# EAGLE design altimetr (EAGLE 9.6.2)
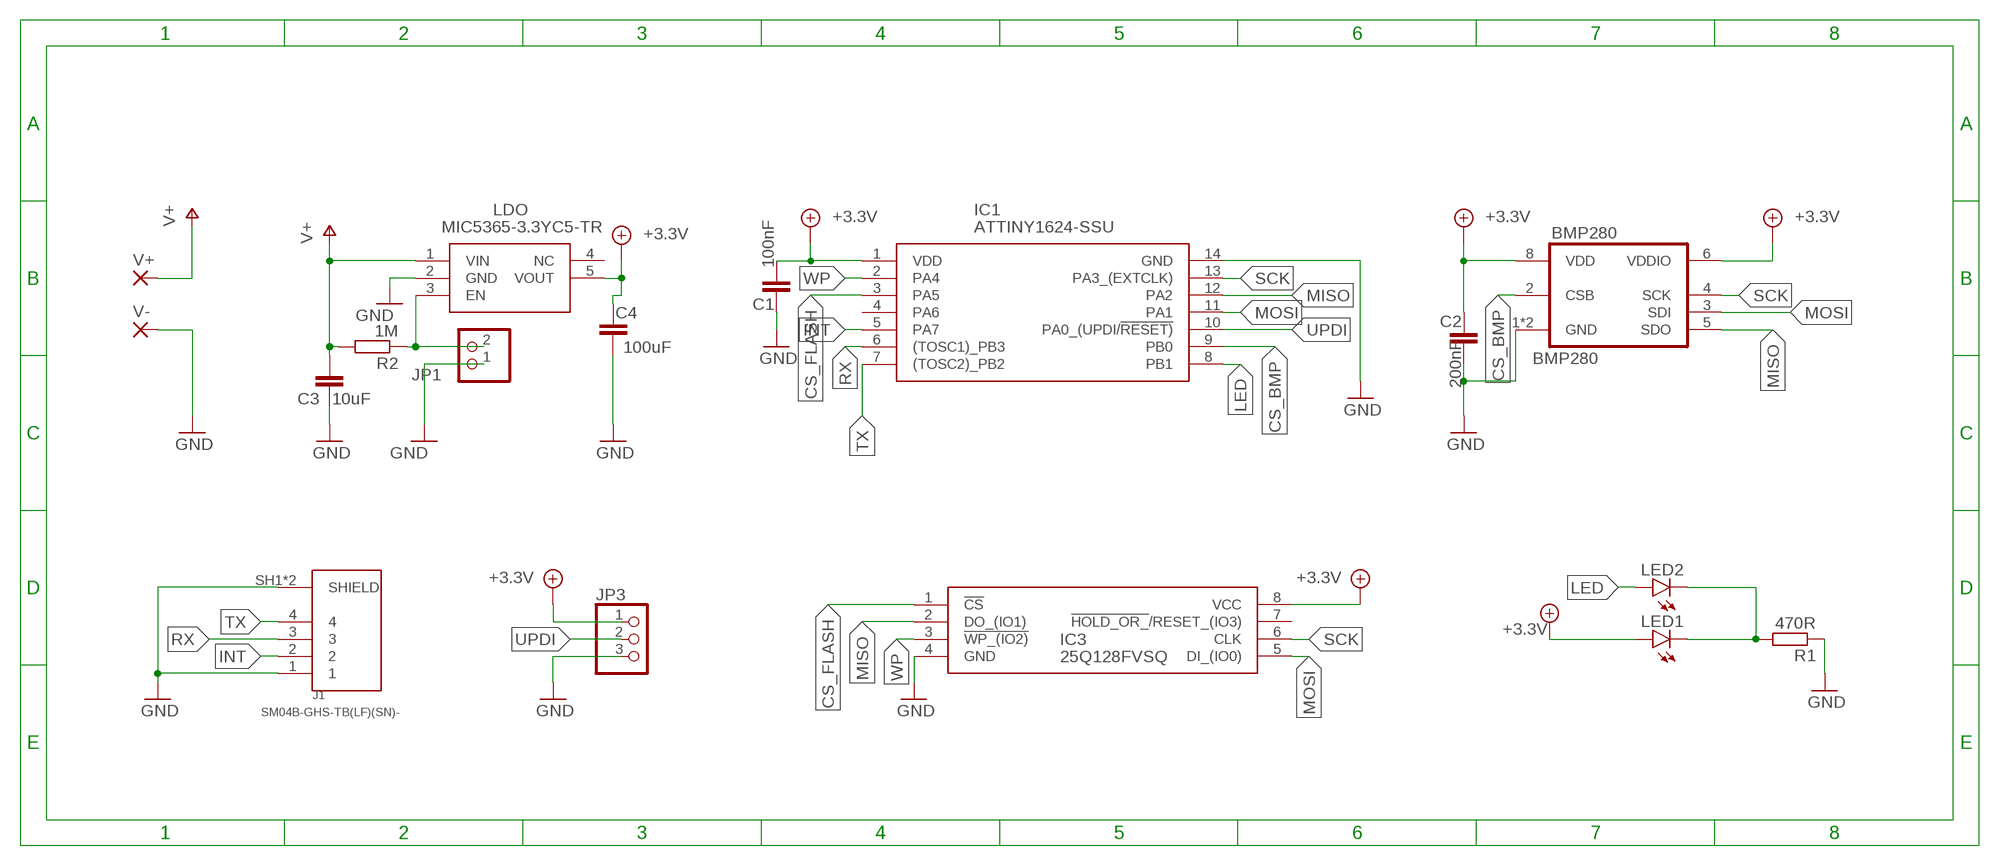
[diagram p0: schematic, sheet 1]

## Parts
BMP280  BMP280  [BMP280]
C1  100nF  C-EUC0805  [C0805]
C2  200nF  C-EUC0805  [C0805]
C3  10uF  C-EUC0805  [C0805]
C4  100uF  C-EUC0805  [C0805]
IC1  ATTINY1624-SSU  [SOIC127P600X175-14N]
IC3  25Q128FVSQ  [SOIC127P790X216-8N]
J1  SM04B-GHS-TB(LF)(SN)-  [JST_SM04B-GHS-TB(LF)(SN)-]
JP1  PINHD-1X2/90  [1X02/90]
JP3  PINHD-1X3/90  [1X03/90]
LDO  MIC5365-3.3YC5-TR  [SOT65P210X110-5N]
LED1  LEDCHIP-LED0805  [CHIP-LED0805]
LED2  LEDCHIP-LED0805  [CHIP-LED0805]
R1  470R  R-EU_R0805  [R0805]
R2  1M  R-EU_R0805  [R0805]
V+  SMD2  [SMD1,27-2,54]
V-  SMD2  [SMD1,27-2,54]

## Nets
+3.3V: BMP280.6(VDDIO) BMP280.8(VDD) C1.1 C2.1 C4.2 IC1.1(VDD) IC3.8(VCC) JP3.1 LDO.5(VOUT) LED1.A
CS_BMP: BMP280.2(CSB) IC1.9(PB0)
CS_FLASH: IC1.3(PA5) IC3.1(!CS)
EN: JP1.2 LDO.3(EN) R2.1
GND: BMP280.1(GND) BMP280.7(GND) C1.2 C2.2 C3.1 C4.1 IC1.14(GND) IC3.4(GND) J1.1 J1.SH1(SHIELD) J1.SH2(SHIELD) JP1.1 JP3.3 LDO.2(GND) R1.1 V-.1(P)
INT: IC1.5(PA7) J1.2
LED: IC1.8(PB1) LED2.A
MISO: BMP280.5(SDO) IC1.12(PA2) IC3.2(DO_(IO1))
MOSI: BMP280.3(SDI) IC1.11(PA1) IC3.5(DI_(IO0))
N$14: LED1.C LED2.C R1.2
RX: IC1.6((TOSC1)_PB3) J1.3
SCK: BMP280.4(SCK) IC1.13(PA3_(EXTCLK)) IC3.6(CLK)
TX: IC1.7((TOSC2)_PB2) J1.4
UPDI: IC1.10(PA0_(UPDI/!RESET)) JP3.2
V+: C3.2 LDO.1(VIN) R2.2 V+.1(P)
WP: IC1.2(PA4) IC3.3(!WP_(IO2))
Unconnected: IC1.4(PA6) IC3.7(!HOLD_OR_!/RESET_(IO3)) LDO.4(NC)

## Library data of the parts
BMP280 = PUTRocketLab_modules:BMP280: The BMP280 is an absolute barometric pressure sensor especially designed for mobile applications. The sensor module is housed in an extremely compact 8-pin metal-lid LGA package with a footprint of only 2.0 × 2.5 mm2 and 0.95 mm package height. Its small dimensions and its low power consumption of 2.7 μA @1Hz allow the implementation in battery driven devices such as mobile phones, GPS modules or watches. The library has been designed by Richard Magdycz <https://www.facebook.com/groups/eaglecadsoftUK>
C1 C3 C4 = rcl:C-EU: CAPACITOR, European symbol; SPICEPREFIX: C
C2 = PUTRocketLab_RCL:C-EU: CAPACITOR, European symbol; SPICEPREFIX: C
IC1 = ATTINY1624-SSU:ATTINY1624-SSU: Microchip ATTINY1624-SSU, 8bit AVR Microcontroller, ATtiny1624, 20MHz, 16 kB Flash, 14-Pin SOIC14 Source: Datasheet <https://ww1.microchip.com/downloads/en/DeviceDoc/ATtiny1624-26-27-DataSheet-DS40002234A.pdf>; DESCRIPTION: Microchip ATTINY1624-SSU, 8bit AVR Microcontroller, ATtiny1624, 20MHz, 16 kB Flash, 14-Pin SOIC14; HEIGHT: 1.75mm; MANUFACTURER_NAME: Microchip; MANUFACTURER_PART_NUMBER: ATTINY1624-SSU; MOUSER_PART_NUMBER: 556-ATTINY1624-SSU; MOUSER_PRICE-STOCK: https://www.mouser.co.uk/ProductDetail/Microchip-Technology-Atmel/ATTINY1624-SSU?qs=vmHwEFxEFR%2FHKYGUmUC%2Fzw%3D%3D
IC3 = 25Q128FVSQ:25Q128FVSQ: 3V 128M-BIT SERIAL FLASH MEMORY WITH DUAL/QUAD SPI & QPI Source: Datasheet <http://www.datasheetbank.com/datasheet-download/691593/1/Winbond/25Q128FVSQ>; DESCRIPTION: 3V 128M-BIT SERIAL FLASH MEMORY WITH DUAL/QUAD SPI & QPI; HEIGHT: 2.16mm; MANUFACTURER_NAME: Winbond; MANUFACTURER_PART_NUMBER: 25Q128FVSQ
J1 = PUTRocketLab_connectors:SM04B-GHS-TB(LF)(SN)-: Conn Header Gh Side 4pos 1.25mm; DESCRIPTION: Connector Header Surface Mount, Right Angle 4 position 0.049 (1.25mm); DIGI-KEY_PART_NUMBER: 455-1566-6-ND; MF: JST Sales; MP: SM04B-GHS-TB(LF)(SN)-; PACKAGE: None; PURCHASE-URL: https://pricing.snapeda.com/search/part/SM04B-GHS-TB(LF)(SN)-/?ref=eda
JP1 = pinhead:PINHD-1X2: PIN HEADER
JP3 = pinhead:PINHD-1X3: PIN HEADER
LDO = MIC5365-3.3YC5-TR:MIC5365-3.3YC5-TR: MICROCHIP - MIC5365-3.3YC5-TR - LDO, FIXED, 3.3V, 0.15A, SC-70-5 Source: Datasheet <http://www.mouser.com/ds/2/268/mic5365-779177.pdf>; ARROW_PART_NUMBER: MIC5365-3.3YC5-TR; ARROW_PRICE-STOCK: https://www.arrow.com/en/products/mic5365-3.3yc5-tr/microchip-technology?region=nac; DESCRIPTION: MICROCHIP - MIC5365-3.3YC5-TR - LDO, FIXED, 3.3V, 0.15A, SC-70-5; HEIGHT: 1.1mm; MANUFACTURER_NAME: Microchip; MANUFACTURER_PART_NUMBER: MIC5365-3.3YC5-TR; MOUSER_PART_NUMBER: 998-MIC5365-3.3YC5TR; MOUSER_PRICE-STOCK: https://www.mouser.co.uk/ProductDetail/Microchip-Technology-Micrel/MIC5365-33YC5-TR?qs=U6T8BxXiZAXvJj%252BPZ%252B301w%3D%3D
LED1 LED2 = led:LED: LED OSRAM: - CHIPLED LG R971, LG N971, LY N971, LG Q971, LY Q971, LO R971, LY R971 LH N974, LH R974 LS Q976, LO Q976, LY Q976 LO Q996 - Hyper CHIPLED LW Q18S LB Q993, LB Q99A, LB R99A - SideLED LS A670, LO A670, LY A670, LG A670, LP A670 LB A673, LV A673, LT A673, LW A673 LH A674 LY A675 LS A676, LA A676, LO A676, LY A676, LW A676 LS A679, LY A679, LG A679 - Hyper Micro SIDELED® LS Y876, LA Y876, LO Y876, LY Y876 LT Y87S - SmartLED LW L88C, LW L88S LB L89C, LB L89S, LG L890 LS L89K, LO L89K, LY L89K LS L896, LA L896, LO L896, LY L896 - TOPLED LS T670, LO T670, LY T670, LG T670, LP T670 LSG T670, LSP T670, LSY T670, LOP T670, LYG T670 LG T671, LOG T671, LSG T671 LB T673, LV T673, LT T673, LW T673 LH T674 LS T676, LA T676, LO T676, LY T676, LB T676, LH T676, LSB T676, LW T676 LB T67C, LV T67C, LT T67C, LS T67K, LO T67K, LY T67K, LW E67C LS E67B, LA E67B, LO E67B, LY E67B, LB E67C, LV E67C, LT E67C LW T67C LS T679, LY T679, LG T679 LS T770, LO T770, LY T770, LG T770, LP T770 LB T773, LV T773, LT T773, LW T773 LH T774 LS E675, LA E675, LY E675, LS T675 LS T776, LA T776, LO T776, LY T776, LB T776 LHGB T686 LT T68C, LB T68C - Hyper Mini TOPLED® LB M676 - Mini TOPLED Santana® LG M470 LS M47K, LO M47K, LY M47K Source: http://www.osram.convergy.de LUXEON: - LUMILED® LXK2-PW12-R00, LXK2-PW12-S00, LXK2-PW14-U00, LXK2-PW14-V00 LXK2-PM12-R00, LXK2-PM12-S00, LXK2-PM14-U00 LXK2-PE12-Q00, LXK2-PE12-R00, LXK2-PE12-S00, LXK2-PE14-T00, LXK2-PE14-U00 LXK2-PB12-K00, LXK2-PB12-L00, LXK2-PB12-M00, LXK2-PB14-N00, LXK2-PB14-P00, LXK2-PB14-Q00 LXK2-PR12-L00, LXK2-PR12-M00, LXK2-PR14-Q00, LXK2-PR14-R00 LXK2-PD12-Q00, LXK2-PD12-R00, LXK2-PD12-S00 LXK2-PH12-R00, LXK2-PH12-S00 LXK2-PL12-P00, LXK2-PL12-Q00, LXK2-PL12-R00 Source: www.luxeon.com KINGBRIGHT: KA-3528ASYC Source: www.kingbright.com
R1 = rcl:R-EU_: RESISTOR, European symbol; SPICEPREFIX: R
R2 = PUTRocketLab_RCL:R-EU_: RESISTOR, European symbol; SPICEPREFIX: R
V+ V- = wirepad:SMD2: SMD PAD

## Board
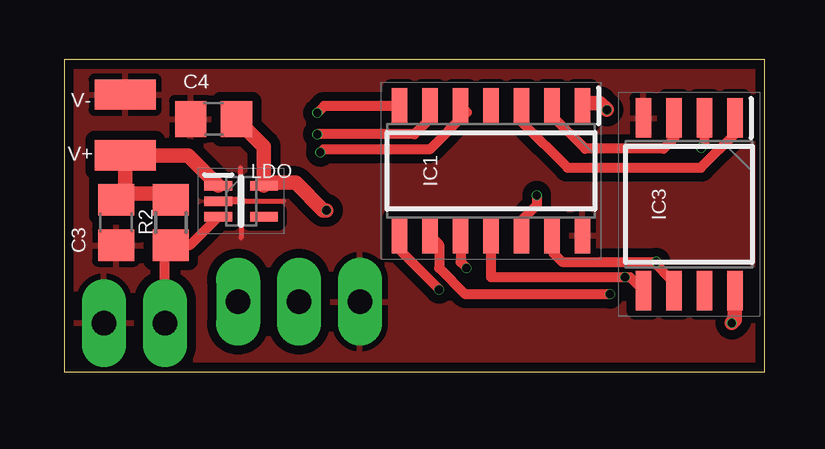
[diagram p1: board, top side]
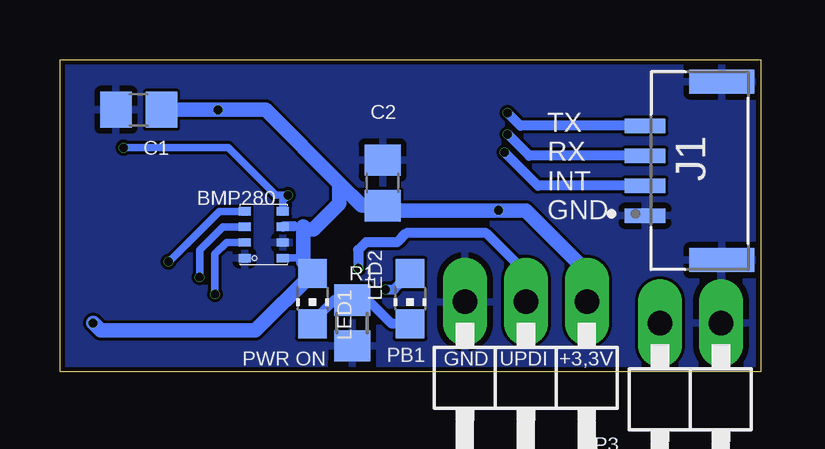
[diagram p2: board, bottom side, seen from below]

Size 29.19 x 13.01 mm. Coordinates in mm from the lower left corner, seen from the top.
Outline: 0,0 29.19,0 29.19,13.01 0,13.01 0,0
Copper layers (1*16): Top 0.035mm / dielectric 1.6mm / Bottom 0.035mm
Design rules "jlcpcb-2layers *": minimum track width 5mil, minimum drill 0.3mm, track to track 5mil, track to pad 5mil, pad to pad 5mil, via to via 5mil, smd to smd 5mil, copper to edge 0.2mm, drill to drill 6mil, minimum pad ring 10mil, minimum via ring 1mil, stop-mask expansion 4mil, vias tented up to drill 0mil, thermal gap 10mil

### Footprints (pad centres in the part's own frame; a part is rotated, then mirrored left to right if it is on the bottom)
BMP280 = smd 0.35 x 0.5: 1 0.975,-0.8; 2 0.325,-0.8; 3 -0.325,-0.8; 4 -0.975,-0.8; 5 -0.975,0.8; 6 -0.325,0.8; 7 0.325,0.8; 8 0.975,0.8
C0805 = smd 1.3 x 1.5: 1 -0.95,0; 2 0.95,0
SOIC127P600X175-14N = smd 1.5 x 0.65: 1 -2.7,3.81; 2 -2.7,2.54; 3 -2.7,1.27; 4 -2.7,0; 5 -2.7,-1.27; 6 -2.7,-2.54; 7 -2.7,-3.81; 8 2.7,-3.81; 9 2.7,-2.54; 10 2.7,-1.27; 11 2.7,0; 12 2.7,1.27; 13 2.7,2.54; 14 2.7,3.81
SOIC127P790X216-8N = smd 1.65 x 0.65: 1 -3.6,1.905; 2 -3.6,0.635; 3 -3.6,-0.635; 4 -3.6,-1.905; 5 3.6,-1.905; 6 3.6,-0.635; 7 3.6,0.635; 8 3.6,1.905
JST_SM04B-GHS-TB(LF)(SN)- = smd 0.6 x 1.7: 1 -1.875,2.275; 2 -0.625,2.275; 3 0.625,2.275; 4 1.875,2.275 | smd 1 x 2.7: SH1 -3.725,-0.925; SH2 3.725,-0.925
1X02/90 = drill 1.016 long: 1 -1.27,-3.81; 2 1.27,-3.81
1X03/90 = drill 1.016 long: 1 -2.54,-3.81; 2 0,-3.81; 3 2.54,-3.81
SOT65P210X110-5N = smd 1.15 x 0.4: 1 -0.95,0.65; 2 -0.95,0; 3 -0.95,-0.65; 4 0.95,-0.65; 5 0.95,0.65
CHIP-LED0805 = smd 1.2 x 1.2: A 0,-1.05; C 0,1.05
R0805 = smd 1.3 x 1.5: 1 -0.95,0; 2 0.95,0
SMD1,27-2,54 = smd 1.27 x 2.54: 1 0,0

### Placement (x,y rotation side)
BMP280  20.7,5.71 270 bottom
C1  25.91,10.92 180 bottom
C2  15.75,7.87 90 bottom
C3  2.16,6.22 90 top
C4  6.22,10.54 0 top
IC1  17.78,8.38 270 top
IC3  26.04,6.99 270 top
J1  2.54,8.38 90 bottom
JP1  2.92,-1.78 180 bottom
JP3  9.78,-0.89 180 bottom
LDO  7.37,7.11 0 top
LED1  18.67,3.05 180 bottom
LED2  14.61,3.05 180 bottom
R1  17.02,2.03 90 bottom
R2  4.45,6.22 90 top
V+  2.54,9.02 270 top
V-  2.54,11.56 90 top

### Tracks (layer width: path | path; a pad name or v marks a point on that pad's centre or on a via)
+3.3V  (via drill 0.35)
  Top 0.61: IC1.1 21.72,11.21 22.32,11.21 v22.61,10.92 | IC3.8 27.94,2.16 v27.81,2.03 | C4.2 8.32,9.4 LDO.5 8.44,7.89 9.64,7.89 10.79,6.73 v10.92,6.73
  Bottom 0.305: BMP280.8 19.22,4.74 19.05,4.57 18.67,4.19 | 19.05,6.06 19.43,6.06
  Bottom 0.406: BMP280.6 19.88,6.06 19.43,6.06
  Bottom 0.61: C1.1 v22.61,10.92 20.62,10.92 17.55,7.85 | 17.55,7.85 16.63,6.92 C2.1 15.55,6.73 v10.92,6.73 9.78,6.73 7.24,4.19 JP3.1 | 19.05,5.93 18.64,5.93 17.55,7.02 17.55,7.85 | 19.05,4.57 19.05,5.93 | 19.05,5.93 19.05,6.06 | 18.67,4.19 LED1.A 21.05,1.71 27.5,1.71 v27.81,2.03
CS_BMP  (via drill 0.35)
  Top 0.406: IC1.9 15.62,5.3 15.62,4.32 16.71,3.23 v22.73,3.23
  Bottom 0.305: BMP280.2 22.25,5.39 22.73,4.91 v22.73,3.23
CS_FLASH
  Top 0.406: IC1.3 19.05,10.43 20.97,8.51 26.53,8.51 27.96,9.94 27.96,10.57 IC3.1
EN
  Top 0.406: LDO.3 5.23,5.27 R2.1 4.19,5.02 JP1.2
GND
  Top 0.2: 7.37,7.11 9.14,7.11
  Top 0.203: 6.98,7.11 6.98,7.21 7.35,7.21 7.35,8.51 | 7.37,7.11 7.37,5.59
  Top 0.254: LDO.2 6.98,7.11 7.37,7.11
  pour Top (isolate 0.381): -0.51,0 36.83,0 36.83,13.84 -0.51,13.84
  pour Bottom: 0,21.59 0.61,20.36 38.1,22.95 38.1,-1.27 0,-1.27
INT  (via drill 0.35)
  Top 0.406: IC1.5 16.77,10.82 15.22,9.27 10.79,9.27 v10.67,9.14
  Bottom 0.406: J1.2 9.28,7.76 v10.67,9.14
LED  (via drill 0.35)
  Top 0.406: IC1.8 13.97,5.08 v15.62,3.43
  Bottom 0.406: LED2.A 15.27,3.43 v15.62,3.43
MISO  (via drill 0.35)
  Top 0.406: IC1.12 19.05,6.32 19.68,6.95 v19.68,7.37 | IC3.2 26.67,9.47 v26.54,9.34
  Bottom 0.305: v26.54,9.34 22.17,9.34 20.19,7.37 v19.68,7.37 19.9,7.15 BMP280.5
MOSI  (via drill 0.35)
  Top 0.406: IC1.11 17.78,3.94 v23.37,3.94 23.58,3.94 IC3.5
  Bottom 0.305: v23.37,3.94 23.37,5.08 22.41,6.04 BMP280.3
N$14
  Bottom 0.406: LED2.C 15.37,2 16.35,2.98 R1.2 17.78,2.98 18.67,2.09 LED1.C
RX  (via drill 0.35)
  Top 0.406: IC1.6 15.24,10.56 14.59,9.91 v10.54,9.91
  Bottom 0.406: J1.3 9.64,9.01 v10.54,9.91
SCK  (via drill 0.35)
  Top 0.305: v24.66,4.59 24.66,4.47
  Top 0.406: IC1.13 20.33,5.67 20.33,5 20.75,4.59 v24.66,4.59 | 24.66,4.47 25.2,3.94 25.27,3.94 25.4,3.81 IC3.6
  Bottom 0.305: v24.66,4.59 22.56,6.69 BMP280.4
TX  (via drill 0.35)
  Top 0.406: IC1.7 10.83,11.08 v10.54,10.79
  Bottom 0.406: J1.4 10,10.26 v10.54,10.79
UPDI  (via drill 0.35)
  Top 0.406: v16.76,4.32 16.51,4.57 IC1.10
  Bottom 0.406: v16.76,4.32 16.76,5.08 16.45,5.4 15.15,5.4 14.76,5.78 11.43,5.78 9.78,4.13 JP3.2
V+
  Top 0.61: R2.2 4.19,7.43 2.41,7.43 2.54,7.55 V+.1 5.16,9.02 LDO.1
  Top 0.813: 2.41,7.43 C3.2
WP
  Top 0.406: IC3.3 25.42,10.57 25.42,9.75 24.97,9.3 21.7,9.3 20.32,10.68 IC1.2

### Text on the board
bNames: TX / RX / INT / GND | GND UPDI +3,3V | PB1 | PWR ON